# EAGLE design mss-cascade (EAGLE 5.11)
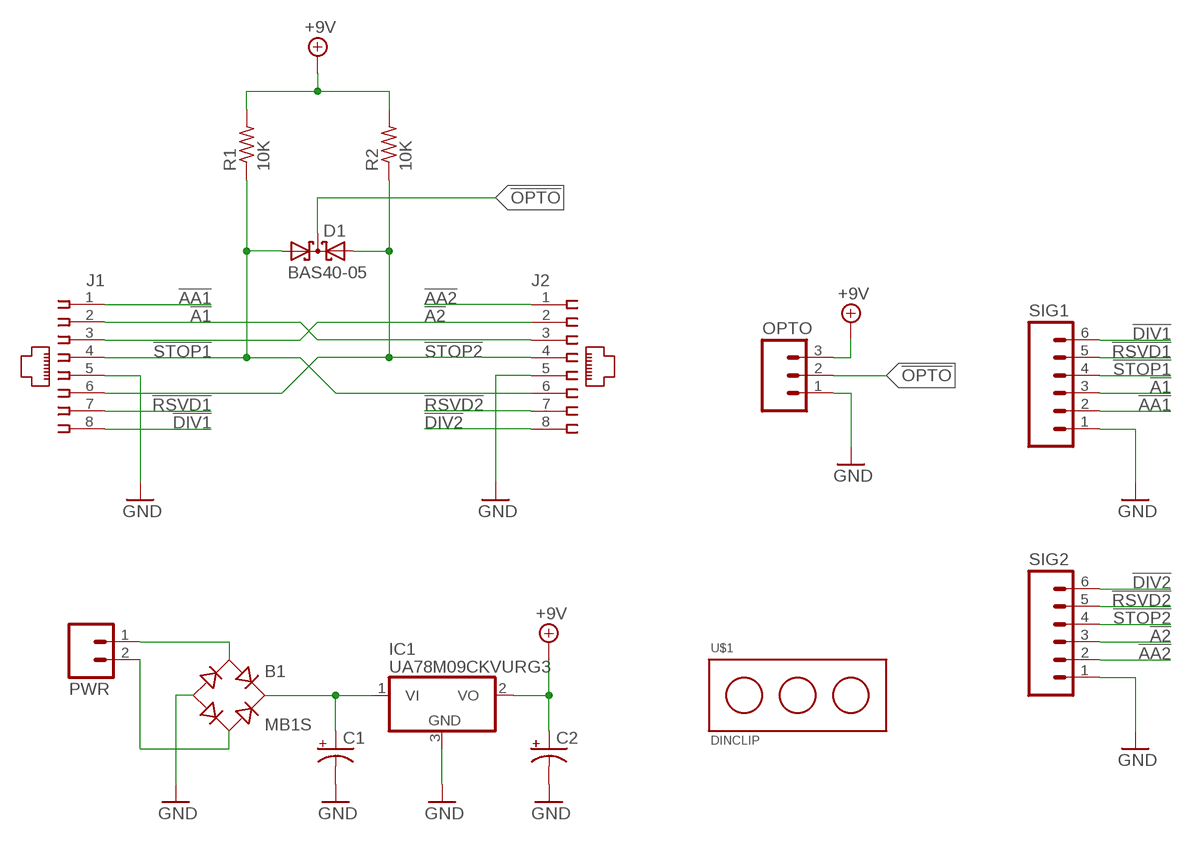
[diagram p0: schematic, sheet 1]

## Parts
B1  MB1S  [SOIC-4]
C1  CPOL-USCT3216  [CT3216]
C2  CPOL-USCT3216  [CT3216]
D1  BAS40-05  [SOT23]
IC1  UA78M09CKVURG3  7808DT  [TO252]
J1  215877-7  [215877-7]
J2  215877-7  [215877-7]
OPTO  M03SCREW  [SCREWTERMINAL-3.5MM-3]
PWR  M025MM  [SCREWTERMINAL-5MM-2]
R1  10K  R-US_R0805W  [R0805W]
R2  10K  R-US_R0805W  [R0805W]
SIG1  M063.5MM-6  [SCREWTERMINAL-3.5MM-6]
SIG2  M063.5MM-6  [SCREWTERMINAL-3.5MM-6]
U$1  DINCLIP  [1201578]

## Nets
!A1: J1.2 J2.3 SIG1.3
!A2: J1.3 J2.2 SIG2.3
!AA1: J1.1 SIG1.2
!AA2: J2.1 SIG2.2
!DIV1: J1.8 SIG1.6
!DIV2: J2.8 SIG2.6
!OPTO: D1.3(C) OPTO.2
!RSVD1: J1.7 SIG1.5
!RSVD2: J2.7 SIG2.5
!STOP1: D1.1(A1) J1.4 J2.6 R1.1 SIG1.4
!STOP2: D1.2(A2) J1.6 J2.4 R2.1 SIG2.4
+9V: C2.+ IC1.2(VO) OPTO.3 R1.2 R2.2
GND: B1.- C1.- C2.- IC1.3(GND) J1.5 J2.5 OPTO.1 SIG1.1 SIG2.1
N$1: B1.~2(AC2) PWR.2
N$2: B1.+ C1.+ IC1.1(VI)
N$3: B1.~1(AC1) PWR.1

## Library data of the parts
B1 = rectifier:MB*S: Bridge Rectifier Source: http://www.fairchildsemi.com/ds/MB/MB6S.pdf
C1 C2 = rcl:CPOL-US: POLARIZED CAPACITOR, American symbol
D1 = diode:BAS40-05: Silicon Schottky Diodes General-purpose diode for high-speed switching
IC1 = adafruit:78*: Positive VOLTAGE REGULATOR Added bigger pads to the TO-92 package
J1 J2 = con-amp:215877-7: AMP connector; OC_FARNELL: unknown; OC_NEWARK: unknown
OPTO = SparkFun:M03: Header 3 Standard 3-pin 0.1" header. Use with straight break away headers (SKU : PRT-00116), right angle break away headers (PRT-00553), swiss pins (PRT-00743), machine pins (PRT-00117), and female headers (PRT-00115). Molex polarized connector foot print use with SKU : PRT-08232 with associated crimp pins and housings.
PWR = SparkFun:M02: Header 2 Standard 2-pin 0.1" header. Use with straight break away headers (SKU : PRT-00116), right angle break away headers (PRT-00553), swiss pins (PRT-00743), machine pins (PRT-00117), and female headers (PRT-00115). Molex polarized connector foot print use with SKU : PRT-08233 with associated crimp pins and housings.
R1 R2 = rcl:R-US_: RESISTOR, American symbol
SIG1 SIG2 = SparkFun:M06: Header 6 Standard 6-pin 0.1" header. Use with straight break away headers (SKU : PRT-00116), right angle break away headers (PRT-00553), swiss pins (PRT-00743), machine pins (PRT-00117), and female headers (PRT-00115). Molex polarized connector foot print use with SKU : PRT-08094 with associated crimp pins and housings. NOTES ON THE VARIANTS LOCK and LOCK_LONGPADS... This footprint was designed to help hold the alignment of a through-hole component (i.e. 6-pin header) while soldering it into place. You may notice that each hole has been shifted either up or down by 0.005 of an inch from it's more standard position (which is a perfectly straight line). This slight alteration caused the pins (the squares in the middle) to touch the edges of the holes. Because they are alternating, it causes a "brace" to hold the component in place. 0.005 has proven to be the perfect amount of "off-center" position when using our standard breakaway headers. Although looks a little odd when you look at the bare footprint, once you have a header in there, the alteration is very hard to notice. Also, if you push a header all the way into place, it is covered up entirely on the bottom side. This idea of altering the position of holes to aid alignment will be further integrated into the Sparkfun Library for other footprints. It can help hold any component with 3 or more connection pins.
U$1 = DINCLIP:DINCLIP

## Board
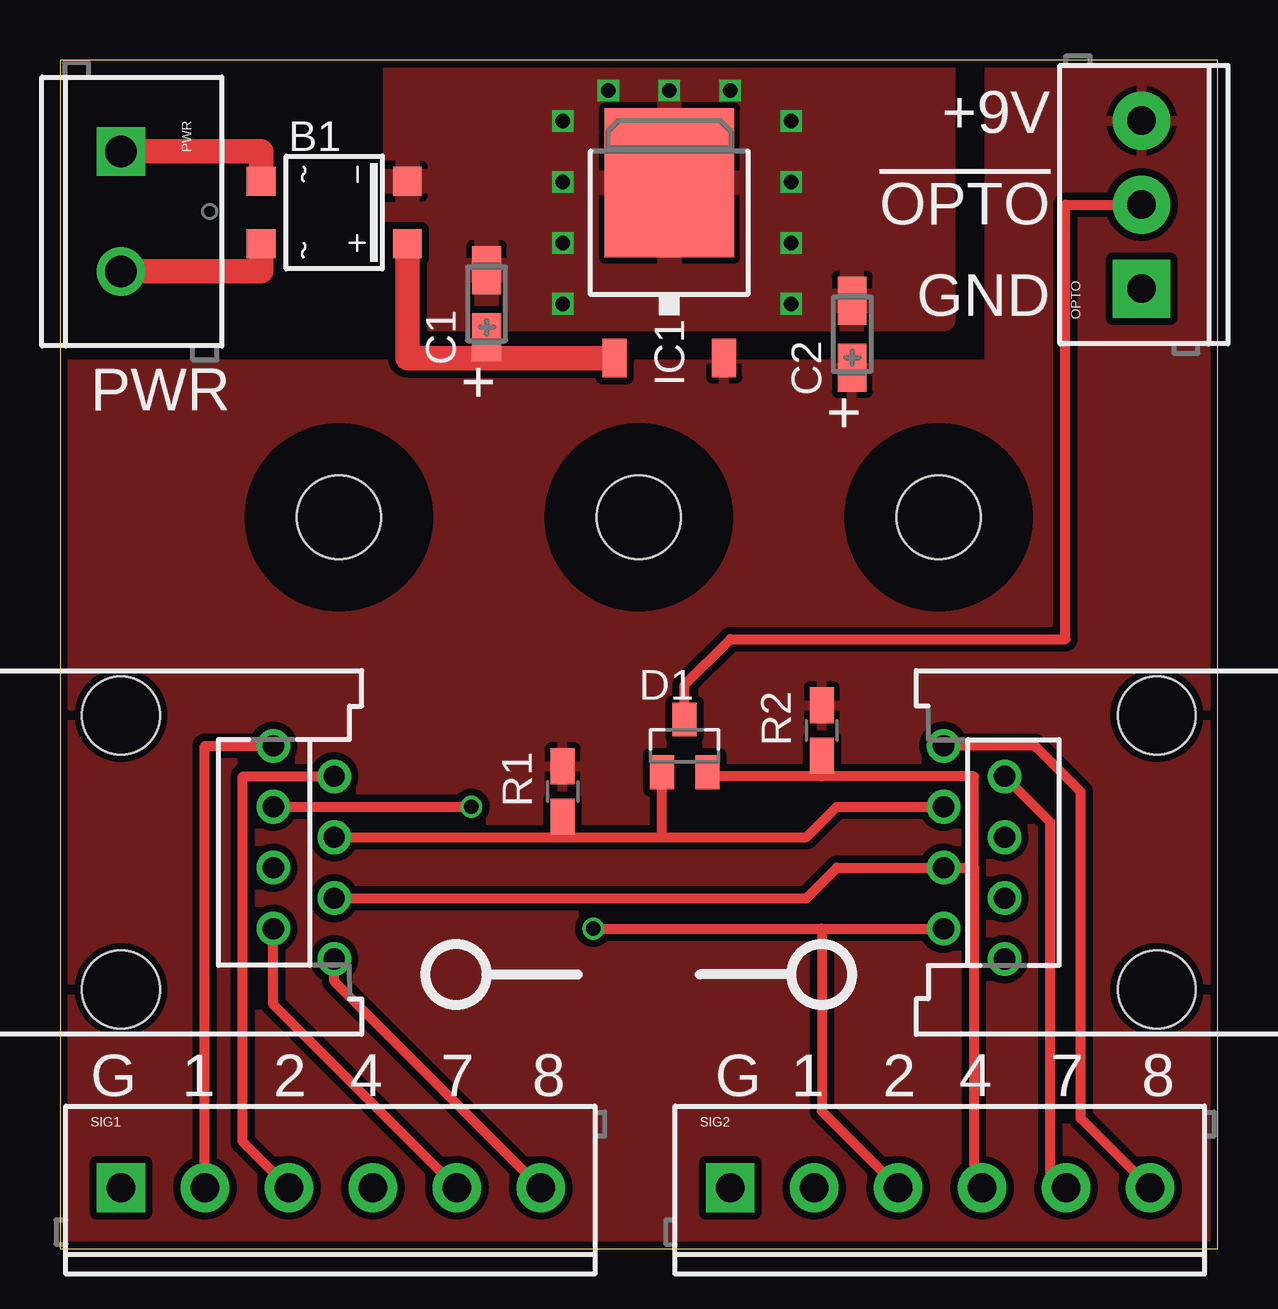
[diagram p1: board, top side]
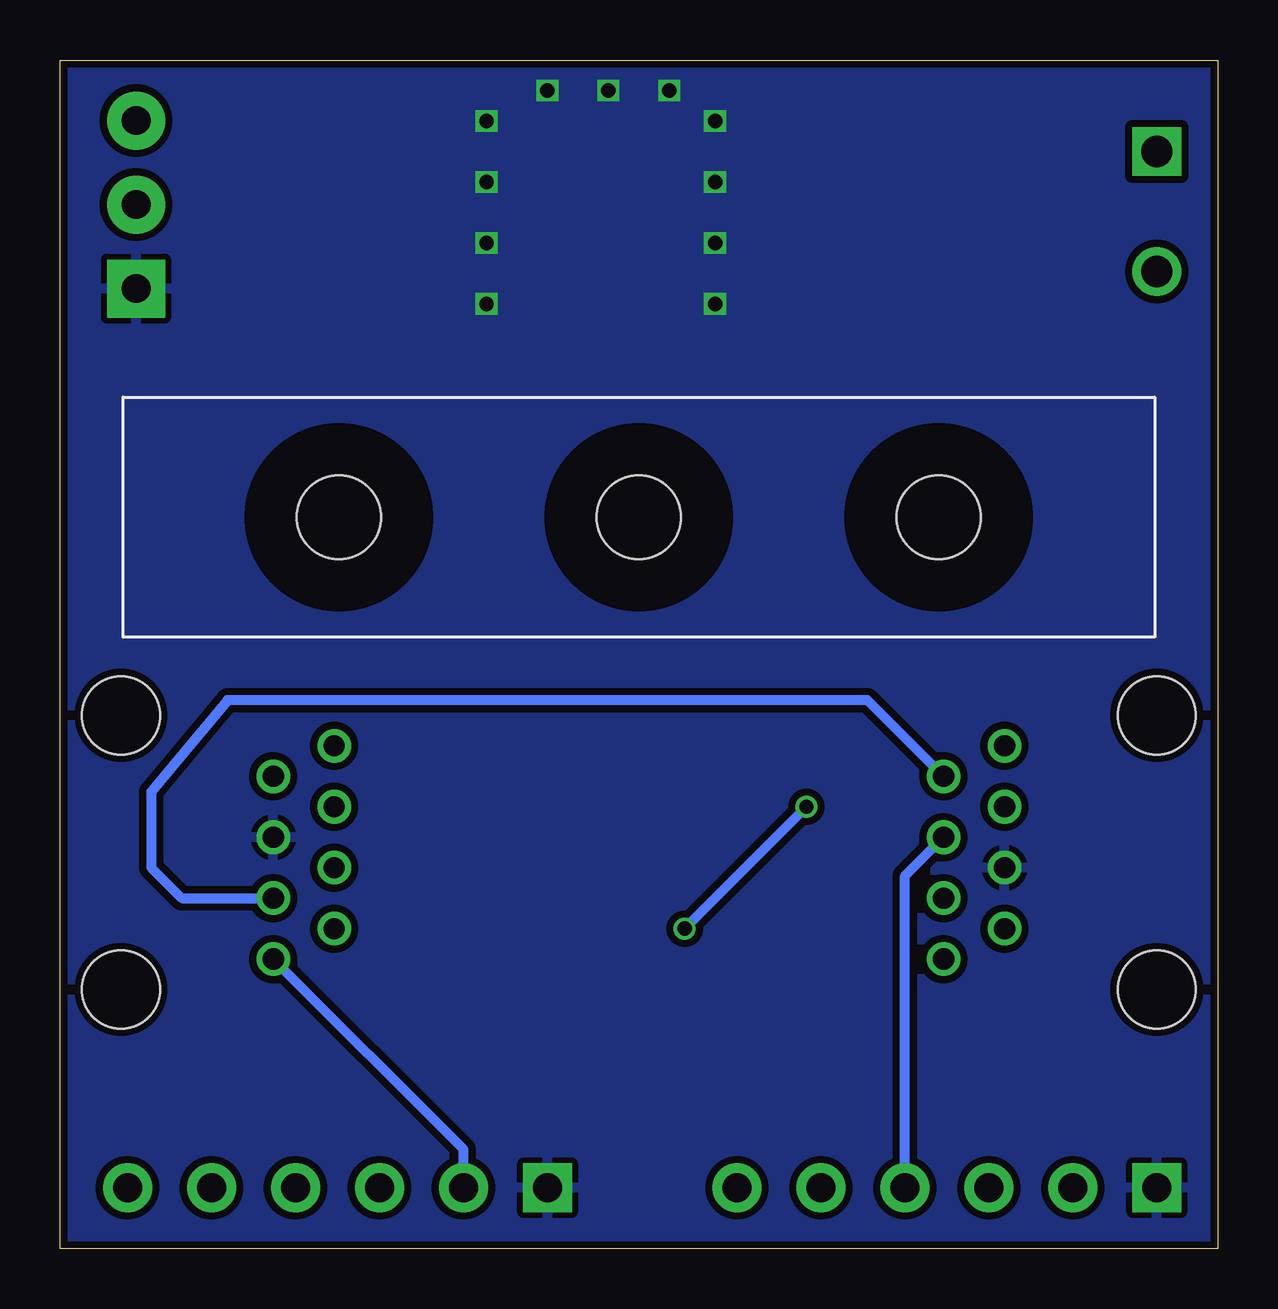
[diagram p2: board, bottom side, seen from below]

Size 48.26 x 49.53 mm. Coordinates in mm from the lower left corner, seen from the top.
Outline: 0,0 48.26,0 48.26,49.53 0,49.53 0,0
Copper layers (1*16): Top 0.035mm / dielectric 1.5mm / Bottom 0.035mm
Design rules "Fusion_eagle_rule_v1.1": minimum track width 6mil, minimum drill 12mil, track to track 6mil, track to pad 6mil, pad to pad 6mil, via to via 6mil, smd to smd 0mil, copper to edge 10mil, drill to drill 10mil, minimum pad ring 10mil, minimum via ring 6mil, stop-mask expansion 2mil, vias tented up to drill 100mil, thermal gap 10mil

### Footprints (pad centres in the part's own frame; a part is rotated, then mirrored left to right if it is on the bottom)
SOIC-4 = smd 1.2 x 1.2: + 1.3,3.05; - -1.3,3.05; ~1 -1.3,-3.05; ~2 1.3,-3.05
CT3216 = smd 2 x 1.2: + -1.4,0; - 1.4,0
SOT23 = smd 1 x 1.4: 1 -0.95,-1.1; 2 0.95,-1.1; 3 0,1.1
TO252 = smd 1 x 1.6: 1 -2.28,-4.8; 2 2.28,-4.8 | smd 5.4 x 6.2: 3 0,2.5
215877-7 = drill 0.889 round: 1 -4.445,6.35; 2 -3.175,8.89; 3 -1.905,6.35; 4 -0.635,8.89; 5 0.635,6.35; 6 1.905,8.89; 7 3.175,6.35; 8 4.445,8.89 | hole 3.251: -5.715,0; 5.715,0
SCREWTERMINAL-3.5MM-3 = drill 1.2 pad 2.413 square: 1 0,0 | drill 1.2 pad 2.413 round: 2 3.5,0; 3 7,0
SCREWTERMINAL-5MM-2 = drill 1.3 pad 2.032 square: 1 0,0 | drill 1.3 pad 2.032 round: 2 5,0
R0805W = smd 1.5 x 1: 1 -1.052,0; 2 1.052,0
SCREWTERMINAL-3.5MM-6 = drill 1.2 pad 2.032 square: 1 0,0 | drill 1.2 pad 2.032 round: 2 3.5,0; 3 7,0; 4 10.5,0; 5 14,0; 6 17.5,0
1201578 = hole 3.5: 0,0; 12.5,0; -12.5,0

### Placement (x,y rotation side)
B1  11.43,43.18 270 top
C1  17.78,39.37 90 top
C2  33.02,38.1 90 top
D1  26.04,20.95 0 top
IC1  25.4,41.91 0 top
J1  2.54,16.51 270 top
J2  45.72,16.51 90 top
OPTO  45.09,40.01 90 top
PWR  2.54,45.72 270 top
R1  20.95,19.05 90 top
R2  31.75,21.59 90 top
SIG1  2.54,2.54 0 top
SIG2  27.94,2.54 0 top
U$1  24.13,30.48 0 top

### Tracks (layer width: path | path; a pad name or v marks a point on that pad's centre or on a via)
!A1
  Top 0.406: J1.2 7.62,19.68 7.62,4.45 7.63,4.45 SIG1.3
  Bottom 0.406: J1.2 14.61,22.86 41.27,22.86 44.45,19.05 44.45,15.88 43.18,14.61 J2.3
!A2  (via drill 0.6)
  Top 0.406: J1.3 v17.14,18.41 | v22.23,13.34 31.75,13.34 | 31.75,13.34 J2.2 | SIG2.3 31.75,5.73 31.75,13.34
  Bottom 0.406: v17.14,18.41 v22.23,13.34
!AA1
  Top 0.406: SIG1.2 6.04,20.95 J1.1
!AA2
  Bottom 0.406: SIG2.2 31.44,4.13 J2.1
!DIV1
  Top 0.406: J1.8 11.43,11.15 SIG1.6
!DIV2
  Top 0.406: J2.8 40.64,20.95 42.55,19.05 42.55,5.43 SIG2.6
!OPTO
  Top 0.406: OPTO.2 41.91,43.51 41.91,25.4 27.94,25.4 26.04,23.5 D1.3
!RSVD1
  Top 0.406: J1.7 8.89,10.19 SIG1.5
!RSVD2
  Top 0.406: J2.7 41.27,17.78 41.27,3.21 SIG2.5
!STOP1
  Top 0.406: 20.95,17.14 25.09,17.14 | J2.6 32.38,18.41 31.11,17.14 25.09,17.14 | 25.09,17.14 D1.1 | 20.95,17.14 R1.1 | J1.4 20.95,17.14
  Bottom 0.406: SIG1.4 13.04,15.54 J1.4
!STOP2
  Top 0.406: J1.6 31.11,14.61 32.38,15.88 J2.4 38.1,15.88 | 31.75,19.68 R2.1 | 31.75,19.68 38.1,19.68 38.1,15.88 | D1.2 26.98,19.68 31.75,19.68 | SIG2.4 38.1,2.88 38.1,15.88
+9V
  pour Top (isolate 0.305): 48.26,49.53 38.73,49.53 38.73,36.83 0,36.83 0,0 48.26,0
GND  (via drill 0.6)
  other vias: 20.95,39.37 20.95,41.91 20.95,44.45 20.95,46.99 22.86,48.26 25.4,48.26 27.94,48.26 30.48,46.99 30.48,44.45 30.48,41.91 30.48,39.37
  pour Top (isolate 0.305): 36.83,38.73 36.83,49.53 13.97,49.53 13.97,38.73
  pour Bottom (isolate 0.305): 0,49.53 0,0 48.26,0 48.26,49.53
N$1
  Top 1.016: B1.~2 8.38,40.72 PWR.2
N$2
  Top 1.016: 17.78,37.11 IC1.1 | 17.78,37.11 C1.+ | B1.+ 14.48,37.11 17.78,37.11
N$3
  Top 1.016: B1.~1 8.38,45.72 PWR.1

### Text on the board
tPlace: +9V | !OPTO | GND | + | + | PWR | G | 1 | 2 | 4 | 7 | 8 | G | 1 | 2 | 4 | 7 | 8